# EAGLE design usbdist (EAGLE 6.2)
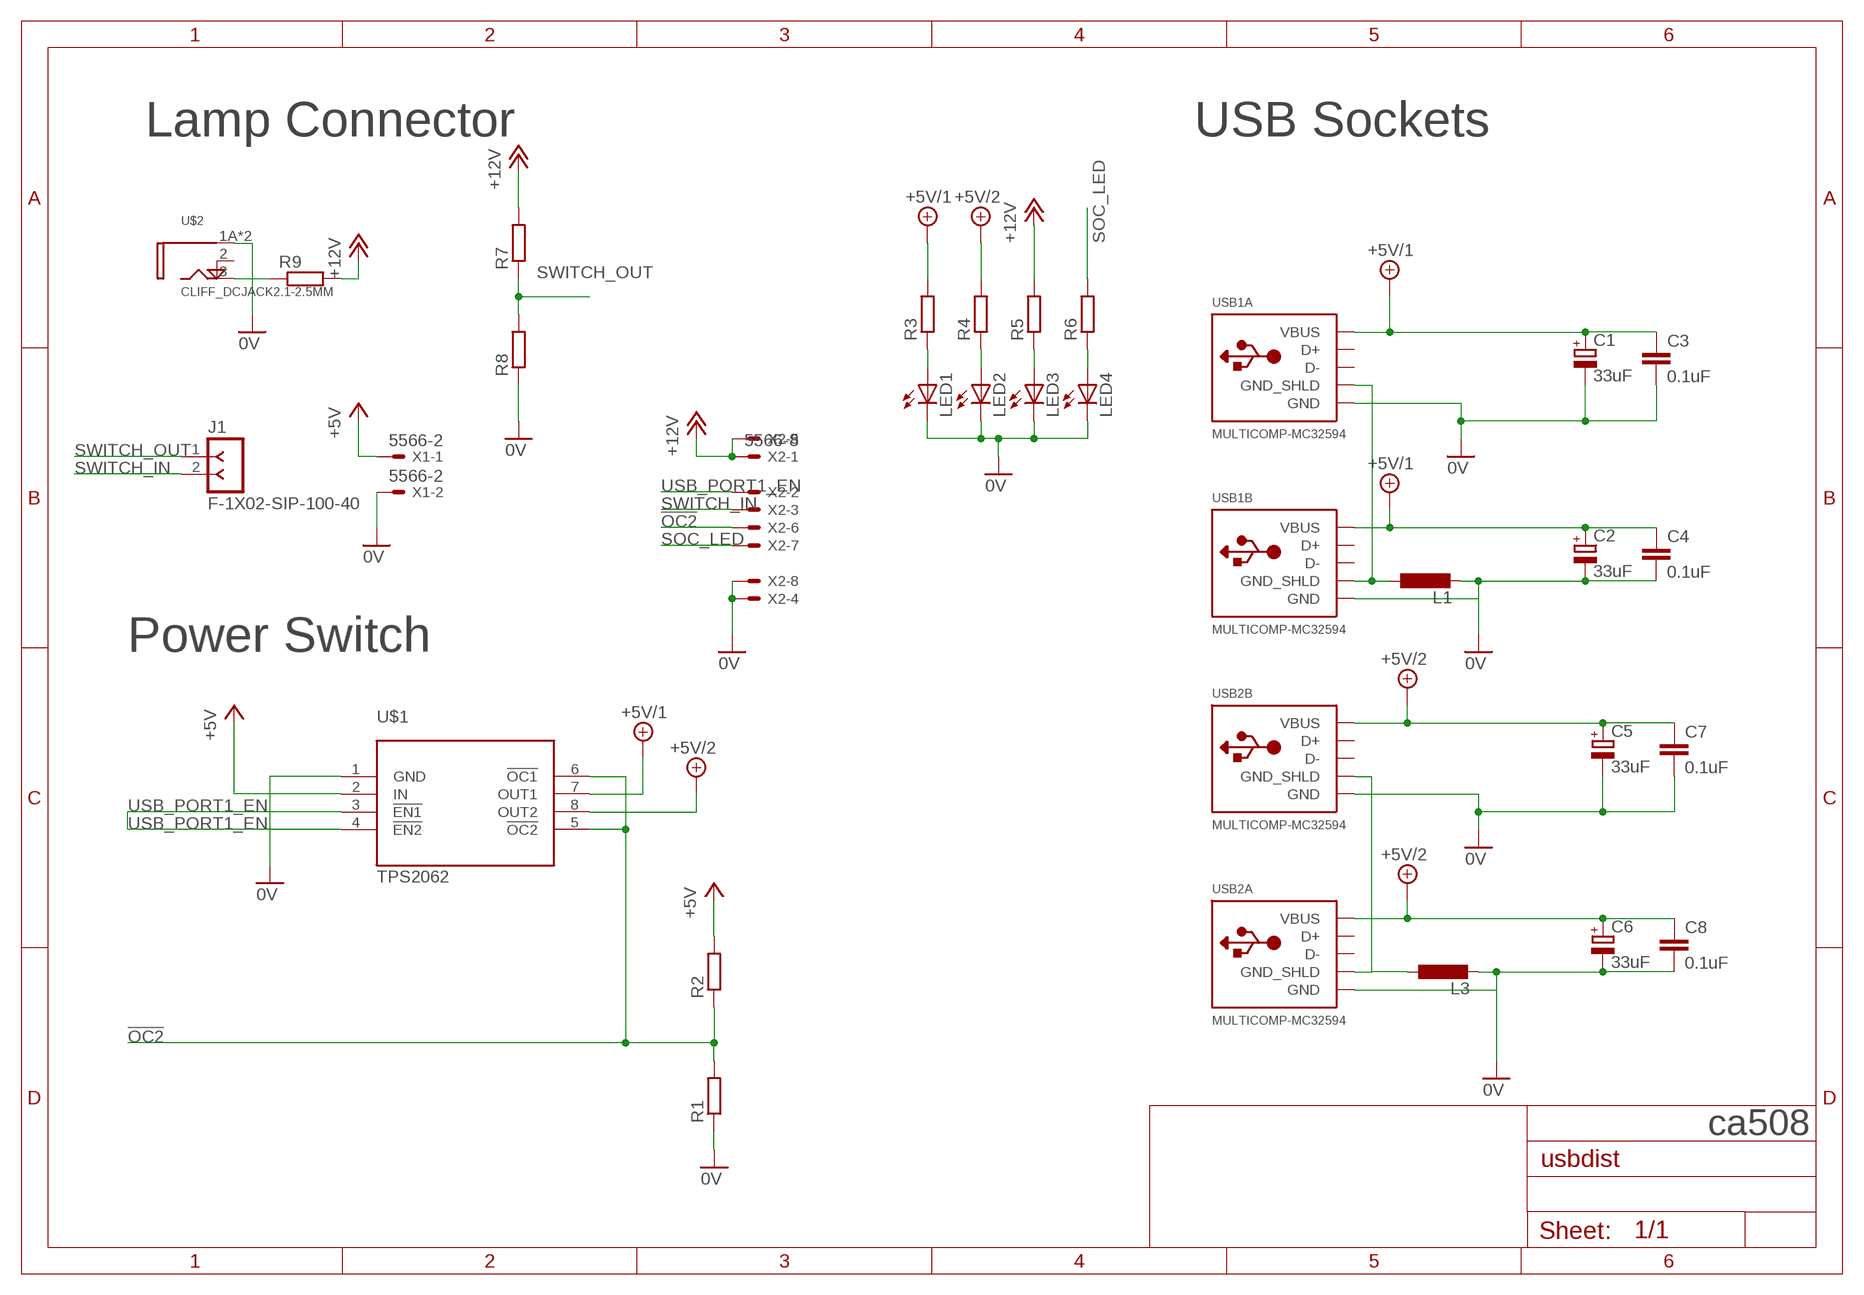
[diagram p0: schematic, sheet 1]

## Parts
C1  33uF  CPOL-EUB/3528-21R  [B/3528-21R]
C2  33uF  CPOL-EUB/3528-21R  [B/3528-21R]
C3  0.1uF  C-EUC0603  [C0603]
C4  0.1uF  C-EUC0603  [C0603]
C5  33uF  CPOL-EUB/3528-21R  [B/3528-21R]
C6  33uF  CPOL-EUB/3528-21R  [B/3528-21R]
C7  0.1uF  C-EUC0603  [C0603]
C8  0.1uF  C-EUC0603  [C0603]
J1  F-1X02-SIP-100-40  [SIP-100-02-40]
L1  L-EUL2012C  [L2012C]
L3  L-EUL2012C  [L2012C]
LED1  LEDCHIP-LED0805  [CHIP-LED0805]
LED2  LEDCHIP-LED0805  [CHIP-LED0805]
LED3  LEDCHIP-LED0805  [CHIP-LED0805]
LED4  LEDCHIP-LED0805  [CHIP-LED0805]
R1  R-EU_R0805  [R0805]
R2  R-EU_R0805  [R0805]
R3  R-EU_R0805  [R0805]
R4  R-EU_R0805  [R0805]
R5  R-EU_R0805  [R0805]
R6  R-EU_R0805  [R0805]
R7  R-EU_R0805  [R0805]
R8  R-EU_R0805  [R0805]
R9  R-EU_0204/5  [0204/5]
U$1  TPS2062  [SO8]
U$2  CLIFF_DCJACK2.1-2.5MM  [FC6814XS]
USB1  MULTICOMP-MC32594  [MC32594]
USB2  MULTICOMP-MC32594  [MC32594]
X1  5566-2  [5566-2]
X2  5566-8  [5566-8]

## Nets
0V: C1.- C2.- C3.2 C4.2 C5.- C6.- C7.2 C8.2 L1.2 L3.2 LED1.C LED2.C LED3.C LED4.C R1.1 R8.1 U$1.1(GND) U$2.1A(SLEEVE) U$2.1B(SLEEVE) USB1.USB1-4(A:GND) USB1.USB2-4(B:GND) USB2.USB1-4(A:GND) USB2.USB2-4(B:GND) X1.2 X2.4 X2.8
!OC2!: R1.2 R2.1 U$1.5(!OC2!) U$1.6(!OC1!) X2.6
+5V: R2.2 U$1.2(IN) X1.1
+5V/1: C1.+ C2.+ C3.1 C4.1 R3.2 U$1.7(OUT1) USB1.USB1-1(A:VBUS) USB1.USB2-1(B:VBUS)
+5V/2: C5.+ C6.+ C7.1 C8.1 R4.2 U$1.8(OUT2) USB2.USB1-1(A:VBUS) USB2.USB2-1(B:VBUS)
+12V: R5.2 R7.2 R9.2 X2.1 X2.5
N$1: L1.1 USB1.P$1(A:GND_SHLD) USB1.P$2(A:GND_SHLD) USB1.P$3(B:GND_SHLD) USB1.P$4(B:GND_SHLD)
N$3: LED3.A R5.1
N$4: LED2.A R4.1
N$5: LED1.A R3.1
N$6: LED4.A R6.1
N$8: L3.1 USB2.P$1(A:GND_SHLD) USB2.P$2(A:GND_SHLD) USB2.P$3(B:GND_SHLD) USB2.P$4(B:GND_SHLD)
N$11: R9.1 U$2.3(TIP)
SOC_LED: R6.2 X2.7
SWITCH_IN: J1.2 X2.3
SWITCH_OUT: J1.1 R7.1 R8.2
USB_PORT1_EN: U$1.3(!EN1!) U$1.4(!EN2!) X2.2
Unconnected: USB1.USB1-2(A:D-) USB1.USB1-3(A:D+) USB1.USB2-2(B:D-) USB1.USB2-3(B:D+) USB2.USB1-2(A:D-) USB2.USB1-3(A:D+) USB2.USB2-2(B:D-) USB2.USB2-3(B:D+)

## Notes on the sheet
- Lamp Connector | USB Sockets
- Power Switch
- ca508

## Power pins joined to a net without a drawn wire
SHUNT: U$2.2(SHUNT)

## Library data of the parts
C1 C2 C5 C6 = resistor:CPOL-EU: POLARIZED CAPACITOR, European symbol; FARNELL: 1672547
C3 C4 C7 C8 = resistor:C-EU: CAPACITOR, European symbol
J1 = con-headers-jp:F-1X02-: FEMALE HEADER
L1 L3 = resistor:L-EU: INDUCTOR, European symbol
LED1-LED4 = led:LED: LED OSRAM: - CHIPLED LG R971, LG N971, LY N971, LG Q971, LY Q971, LO R971, LY R971 LH N974, LH R974 LS Q976, LO Q976, LY Q976 LO Q996 - Hyper CHIPLED LW Q18S LB Q993, LB Q99A, LB R99A - SideLED LS A670, LO A670, LY A670, LG A670, LP A670 LB A673, LV A673, LT A673, LW A673 LH A674 LY A675 LS A676, LA A676, LO A676, LY A676, LW A676 LS A679, LY A679, LG A679 - Hyper Micro SIDELED® LS Y876, LA Y876, LO Y876, LY Y876 LT Y87S - SmartLED LW L88C, LW L88S LB L89C, LB L89S, LG L890 LS L89K, LO L89K, LY L89K LS L896, LA L896, LO L896, LY L896 - TOPLED LS T670, LO T670, LY T670, LG T670, LP T670 LSG T670, LSP T670, LSY T670, LOP T670, LYG T670 LG T671, LOG T671, LSG T671 LB T673, LV T673, LT T673, LW T673 LH T674 LS T676, LA T676, LO T676, LY T676, LB T676, LH T676, LSB T676, LW T676 LB T67C, LV T67C, LT T67C, LS T67K, LO T67K, LY T67K, LW E67C LS E67B, LA E67B, LO E67B, LY E67B, LB E67C, LV E67C, LT E67C LW T67C LS T679, LY T679, LG T679 LS T770, LO T770, LY T770, LG T770, LP T770 LB T773, LV T773, LT T773, LW T773 LH T774 LS E675, LA E675, LY E675, LS T675 LS T776, LA T776, LO T776, LY T776, LB T776 LHGB T686 LT T68C, LB T68C - Hyper Mini TOPLED® LB M676 - Mini TOPLED Santana® LG M470 LS M47K, LO M47K, LY M47K Source: http://www.osram.convergy.de LUXEON: - LUMILED® LXK2-PW12-R00, LXK2-PW12-S00, LXK2-PW14-U00, LXK2-PW14-V00 LXK2-PM12-R00, LXK2-PM12-S00, LXK2-PM14-U00 LXK2-PE12-Q00, LXK2-PE12-R00, LXK2-PE12-S00, LXK2-PE14-T00, LXK2-PE14-U00 LXK2-PB12-K00, LXK2-PB12-L00, LXK2-PB12-M00, LXK2-PB14-N00, LXK2-PB14-P00, LXK2-PB14-Q00 LXK2-PR12-L00, LXK2-PR12-M00, LXK2-PR14-Q00, LXK2-PR14-R00 LXK2-PD12-Q00, LXK2-PD12-R00, LXK2-PD12-S00 LXK2-PH12-R00, LXK2-PH12-S00 LXK2-PL12-P00, LXK2-PL12-Q00, LXK2-PL12-R00 Source: www.luxeon.com KINGBRIGHT: KA-3528ASYC Source: www.kingbright.com
R1-R9 = resistor:R-EU_: RESISTOR, European symbol
U$1 = farnellparts:TPS2062; FARNELL: 1560652
U$2 = minibox-parts:CLIFF_DCJACK
USB1 USB2 = connectors-bbng:MULTICOMP-MC32594
X1 = con-molex:5566-2: Mini FIT connector 2 pol Source: http://www.molex.com; OC_FARNELL: 1822072; OC_NEWARK: unknown
X2 = con-molex:5566-8: Mini FIT connector 8 pol Source: http://www.molex.com; OC_FARNELL: unknown; OC_NEWARK: unknown

## Board
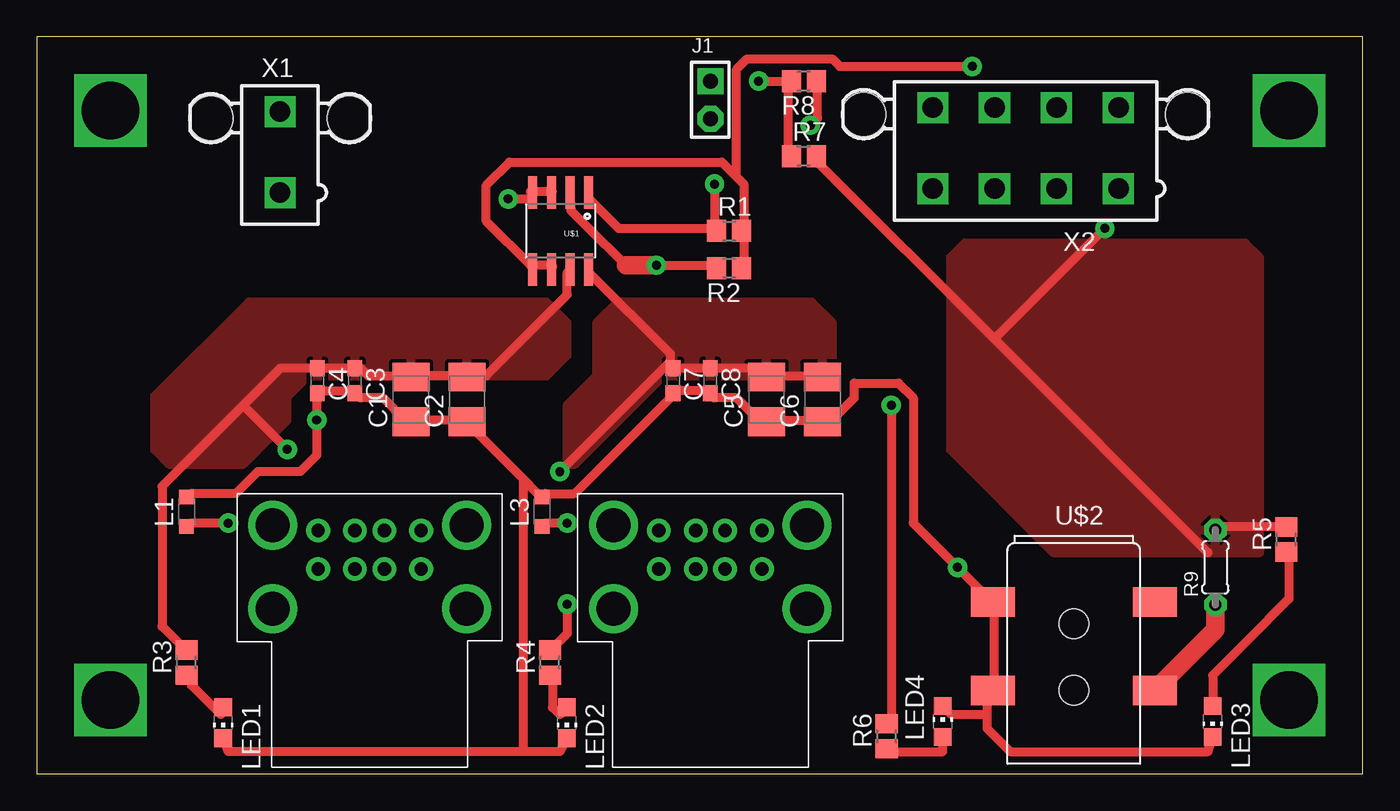
[diagram p1: board, top side]
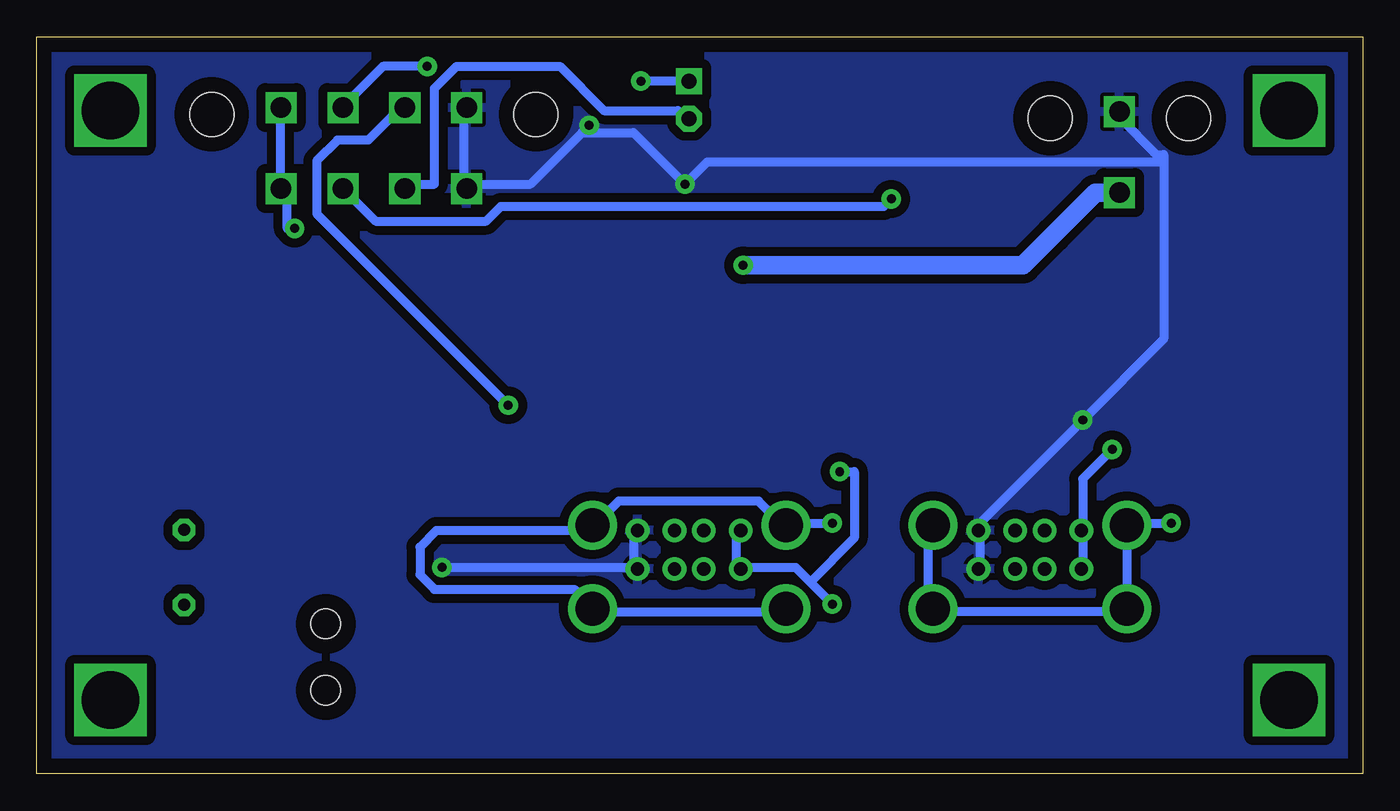
[diagram p2: board, bottom side, seen from below]

Size 90 x 50 mm. Coordinates in mm from the lower left corner, seen from the top.
Outline: 0,0 90,0 90,50 0,50 0,0
Copper layers (1*16): Top 0.035mm / dielectric 1.5mm / Bottom 0.035mm
Design rules: minimum track width 24mil, minimum drill 24mil, track to track 10mil, track to pad 10mil, pad to pad 10mil, via to via 10mil, smd to smd 8mil, copper to edge 40mil, drill to drill 14mil, minimum pad ring 14mil, minimum via ring 14mil, stop-mask expansion 4mil, vias tented up to drill 0mil, thermal gap 10mil
tRestrict: area 14,9 to 31,19; area 37,9 to 54,19; area 59,38 to 75,47; area 44,43 to 47,48; area 15,37 to 18,47

### Footprints (pad centres in the part's own frame; a part is rotated, then mirrored left to right if it is on the bottom)
B/3528-21R = smd 1.95 x 2.5: + 1.525,0; - -1.525,0
C0603 = smd 1.1 x 1: 1 -0.85,0; 2 0.85,0
SIP-100-02-40 = drill 1.016 pad 1.778 square: 1 -1.27,0 | drill 1.016 pad 1.778 octagon: 2 1.27,0
L2012C = smd 1 x 1: 1 -1,0; 2 1,0
CHIP-LED0805 = smd 1.2 x 1.2: A 0,-1.05; C 0,1.05
R0805 = smd 1.3 x 1.5: 1 -0.85,0; 2 0.85,0
0204/5 = drill 0.813 octagon: 1 -2.54,0; 2 2.54,0
SO8 = smd 0.61 x 2.21: 1 -1.905,-2.616; 2 -0.635,-2.616; 3 0.635,-2.616; 4 1.905,-2.616; 5 1.905,2.616; 6 0.635,2.616; 7 -0.635,2.616; 8 -1.905,2.616
FC6814XS = smd 3 x 2: 1A -5.5,-4.5; 1B -5.5,1.5; 2 5.5,1.5; 3 5.5,-4.5 | hole 2: 0,0; 0,-4.5
MC32594 = drill 2.3: P$1 -6.57,0.35; P$2 6.57,0.35; P$3 -6.57,-5.33; P$4 6.57,-5.33 | drill 0.9: USB1-1 -3.5,0; USB1-2 -1,0; USB1-3 1,0; USB1-4 3.5,0; USB2-1 -3.5,-2.62; USB2-2 -1,-2.62; USB2-3 1,-2.62; USB2-4 3.5,-2.62
5566-2 = drill 1.4 square: 1 0,-2.75; 2 0,2.75 | hole 3: 4.7,2.29; -4.7,2.29
5566-8 = drill 1.4 square: 1 6.3,-2.75; 2 2.1,-2.75; 3 -2.1,-2.75; 4 -6.3,-2.75; 5 6.3,2.75; 6 2.1,2.75; 7 -2.1,2.75; 8 -6.3,2.75 | hole 3: 11,2.29; -11,2.29

### Placement (x,y rotation side)
C1  25.4,25.4 90 top
C2  29.21,25.4 90 top
C3  21.59,26.67 270 top
C4  19.05,26.67 270 top
C5  49.53,25.4 90 top
C6  53.34,25.4 90 top
C7  43.18,26.67 270 top
C8  45.72,26.67 270 top
J1  45.72,45.72 270 top
L1  10.16,17.78 90 top
L3  34.29,17.78 90 top
LED1  12.65,3.46 180 top
LED2  35.98,3.46 180 top
LED3  79.82,3.54 180 top
LED4  61.5,3.54 0 top
R1  46.99,36.83 0 top
R2  46.99,34.29 180 top
R3  10.16,7.54 90 top
R4  34.83,7.54 90 top
R5  84.82,15.89 90 top
R6  57.69,2.54 90 top
R7  52.07,41.91 0 top
R8  52.07,46.99 180 top
R9  80,14 90 top
U$1  35.56,36.83 180 top
U$2  70.39,10.16 0 top
USB1  22.59,16.51 0 top
USB2  45.72,16.51 0 top
X1  16.51,42.18 0 top
X2  67.12,42.45 0 top

### Tracks (layer width: path | path; a pad name or v marks a point on that pad's centre or on a via)
0V  (via drill 0.61)
  Top 0.61: 46,37 39.5,37 37.5,39 U$1.1 | v52.5,44 53,44.5 53,46.5 R8.1 | v46,40 46,37 | 46,37 R1.1 | 64.5,4 62.09,4 LED4.C | 64.5,4 64.5,5.5 U$2.1A 65,6 65,11.5 U$2.1B 64.5,12 v62.5,14 59.5,17 59.5,25.5 58.5,26.5 55.5,26.5 55.5,25.5 53.5,23.5 C6.- 53,24 50,24 C5.- 49.5,23.5 47.5,25.5 46,25.5 C8.2 45.5,26 43.5,26 C7.2 43,25.5 36.5,19 34.5,19 L3.2 34,19 33,20 | 64.5,4 64.5,3.08 66.08,1.5 79.5,1.5 LED3.C | 33,1.5 35.5,1.5 LED2.C | 33,1.5 13,1.5 LED1.C | L1.2 10.5,19 13.5,19 15,20.5 17.88,20.5 19,21.62 v19,24 19,25.5 C4.2 19.5,26 21.5,26 C3.2 22,25.5 23.5,25.5 25,24 C1.- 25.5,24 29,24 C2.- 29.5,23.5 33,20 | 33,20 33,1.5
  Bottom 0.61: 53,43.5 56.5,40 60.5,40 X2.4 61,40 61,45 X2.8 | 53,43.5 v52.5,44 | 53,43.5 49.5,43.5 v46,40 44.5,41.5 13.5,41.5 | USB1.USB2-4 26,14 26,16.5 USB1.USB1-4 26,17 v19,24 13.5,29.5 13.5,41.5 | 13.5,41.5 13.5,42 14,42 16.5,44.5 X1.2 | 49.5,14 49.5,16.5 USB2.USB1-4 | v62.5,14 49.5,14 | 49.5,14 USB2.USB2-4
  pour Bottom (isolate 0.61): 0,50 90,50 90,0 0,0
!OC2!  (via drill 0.61)
  Top 0.61: R2.1 48,34.5 48,36.5 R1.2 48,37 48,40 47.5,40.5 | 33.5,34.5 35,34.5 U$1.6 | 47.5,40.5 46.5,41.5 32.08,41.5 30.5,39.92 30.5,37.5 33.5,34.5 | 33.5,34.5 U$1.5 | v63.5,48 54.5,48 54,48.5 48.21,48.5 47.5,47.79 47.5,40.5
  Bottom 0.61: v63.5,48 66.5,48 69,45.5 X2.6
+5V  (via drill 0.61)
  Top 0.61: v42.05,34.5 46,34.5 R2.2 | 40,34.5 37.25,37.2 36.25,38.2 36.2,38.95 U$1.2
  Top 1.27: v42.05,34.5 40,34.5
  Bottom 1.27: X1.1 18.13,39.43 21,36.56 23.06,34.5 v42.05,34.5
+5V/1  (via drill 0.61)
  Top 0.61: U$1.7 36,34 36,32.5 30.5,27 29.5,27 C2.+ 29,27 25.5,27 C1.+ 25,27 22.5,27 22,27.5 C3.1 21.5,27.5 19.5,27.5 C4.1 19,27.5 16.5,27.5 14,25 | 14,25 8.5,19.5 8.5,10 10,8.5 R3.2 | 14,25 v17,22
  Bottom 0.61: USB1.USB2-1 19,14 19,16.5 USB1.USB1-1 19,17 19,20 v17,22
  pour Top: 36,28.41 36,30.59 34.59,32 14.4,32 8,25.6 8,22 9,21 14,21 17,24 17,25.59 18.41,27 34.59,27
+5V/2  (via drill 0.61)
  Top 0.61: v36,11.5 36,9.5 35,8.5 R4.2 | 43,28 43,28.5 37.5,34 U$1.8 | C6.+ 53,27 50,27 C5.+ 49.5,27 49.5,27.5 46,27.5 C8.1 45.5,27.5 43.5,27.5 C7.1 43,28 | 43,28 v35.5,20.5
  Bottom 0.61: 37.5,13 38.5,14 42,14 USB2.USB2-1 42.5,14 42.5,16.5 USB2.USB1-1 | 37.5,13 v36,11.5 | 37.5,13 34.5,16 34.5,20.5 v35.5,20.5
  pour Top: 52.59,32 39.41,32 38,30.59 38,27 36,25 36,23 36,21 36.53,21 41,25.47 42.53,27 54,27 54,30.59
+12V  (via drill 0.61)
  Top 0.61: 79.5,15 65,29.5 | 65,29.5 53,41.5 R7.2 | 65,29.5 v72.5,37 | R5.2 80,16.74 R9.2
  Bottom 0.61: X2.5 73.5,45 73.5,40 X2.1 73,39.5 73,37 v72.5,37
  pour Top: 62,35 62,22 69,15 83,15 83,35 82,36 63,36
N$1  (via drill 0.61)
  Top 0.61: v13,17 10.5,17 L1.1
  Bottom 0.61: USB1.P$2 29.5,16.5 29.5,11.5 USB1.P$4 29,11 16.5,11 USB1.P$3 16,11.5 16,16.5 USB1.P$1 16,17 v13,17
N$2  (via drill 3.9 pad 2.54)
  other vias: 5,45
N$3
  Top 0.61: R5.1 85,15.04 85,11.86 82.14,9 79.82,6.68 LED3.A
N$4
  Top 0.61: LED2.A 35.5,4 35,4.5 35,6.5 R4.1
N$5
  Top 0.61: LED1.A 12.5,4 10.5,6 10.5,6.5 R3.1
N$6
  Top 0.61: LED4.A 61.5,1.5 58,1.5 R6.1
N$7  (via drill 3.9 pad 2.54)
  other vias: 85,45
N$8  (via drill 0.61)
  Top 0.61: v36,17 34.5,17 L3.1
  Bottom 0.61: USB2.P$3 39.5,11 52,11 USB2.P$4 52.5,11.5 53.5,12.5 63,12.5 64,13.5 64,15.38 62.88,16.5 52.5,16.5 USB2.P$2 52,17 50.5,18.5 41,18.5 39.5,17 USB2.P$1 39,17 v36,17
N$9  (via drill 3.9 pad 2.54)
  other vias: 85,5
N$10  (via drill 3.9 pad 2.54)
  other vias: 5,5
N$11
  Top 1.27: U$2.3 80,9.77 R9.1
SOC_LED  (via drill 0.61)
  Top 0.61: v58,25 58,3.5 R6.2
  Bottom 0.61: v58,25 71,38 71,41.59 69.59,43 67.5,43 65.5,45 X2.7
SWITCH_IN
  Bottom 0.61: J1.2 46,44.5 46.5,45 51.5,45 54.5,48 61.5,48 63,46.5 63,40 65,40 X2.3
SWITCH_OUT  (via drill 0.61)
  Top 0.61: R7.1 51,42 51,46.5 R8.2 51,47 v49,47
  Bottom 0.61: v49,47 46,47 J1.1
USB_PORT1_EN  (via drill 0.61)
  Top 0.61: U$1.3 35,39.5 33.5,39.5 U$1.4 33.5,39 v32,39
  Bottom 0.61: v32,39 32.5,38.5 58.5,38.5 59.5,37.5 67,37.5 69,39.5 X2.2